# EAGLE design AND_OR (EAGLE 7.2.0)
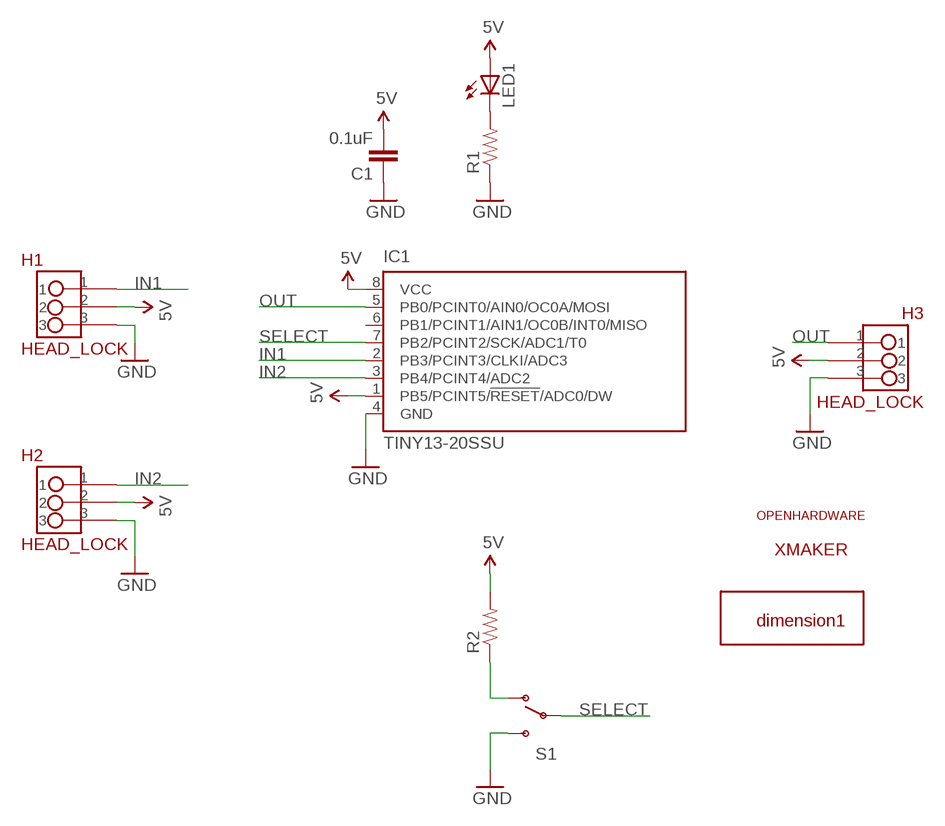
[diagram p0: schematic, sheet 1]

## Parts
C1  0.1uF  0.1UF-25V(+80/-20%)(0603)  [0603-CAP]
H1  HEAD_LOCK  [HEAD_LOCK]
H2  HEAD_LOCK  [HEAD_LOCK]
H3  HEAD_LOCK  [HEAD_LOCK]
IC1  TINY13-20SSU  [8S1]
LED1  LEDSML0603  [SML0603]
R1  RESISTOR0603-RES  [0603-RES]
R2  RESISTOR0603-RES  [0603-RES]
S1  SWITCH-SPDTKIT  [SWITCH-SPDT_KIT]
U$2  XMAKERLOGO2  [XMAKERLOGO2]
U$3  DIMENSION1  [DIMENSION1]
U$4  OPENHARDWARE  [OPENHARDWARE]

## Nets
5V: C1.2 H1.2 H2.2 H3.2 IC1.1(PB5/PCINT5/!RESET!/ADC0/DW) IC1.8(VCC) LED1.A R2.2
GND: C1.1 H1.3 H2.3 H3.3 IC1.4(GND) R1.1 S1.3(S)
IN1: H1.1 IC1.2(PB3/PCINT3/CLKI/ADC3)
IN2: H2.1 IC1.3(PB4/PCINT4/ADC2)
N$1: LED1.C R1.2
N$2: R2.1 S1.1(O)
OUT: H3.1 IC1.5(PB0/PCINT0/AIN0/OC0A/MOSI)
SELECT: IC1.7(PB2/PCINT2/SCK/ADC1/T0) S1.2(P)
Unconnected: IC1.6(PB1/PCINT1/AIN1/OC0B/INT0/MISO)

## Library data of the parts
C1 = SparkFun-Capacitors:0.1UF-25V(+80/-20%)(0603): CAP-00810 Ceramic Standard decoupling cap; PROD_ID: CAP-00810
H1-H3 = HEAD_LOCK:HEAD_LOCK: 带锁的排座
IC1 = atmel:TINY13: 8-bit AVR Microcontroller with 1K Bytes In-System Programmable Flash Source: http://www.atmel.com/dyn/resources/prod_documents/2535S.pdf; MPN: ATTINY13-20SSU; OC_FARNELL: 1455133; OC_NEWARK: 58M3771
LED1 = led:LED: LED OSRAM: - CHIPLED LG R971, LG N971, LY N971, LG Q971, LY Q971, LO R971, LY R971 LH N974, LH R974 LS Q976, LO Q976, LY Q976 LO Q996 - Hyper CHIPLED LW Q18S LB Q993, LB Q99A, LB R99A - SideLED LS A670, LO A670, LY A670, LG A670, LP A670 LB A673, LV A673, LT A673, LW A673 LH A674 LY A675 LS A676, LA A676, LO A676, LY A676, LW A676 LS A679, LY A679, LG A679 - Hyper Micro SIDELED® LS Y876, LA Y876, LO Y876, LY Y876 LT Y87S - SmartLED LW L88C, LW L88S LB L89C, LB L89S, LG L890 LS L89K, LO L89K, LY L89K LS L896, LA L896, LO L896, LY L896 - TOPLED LS T670, LO T670, LY T670, LG T670, LP T670 LSG T670, LSP T670, LSY T670, LOP T670, LYG T670 LG T671, LOG T671, LSG T671 LB T673, LV T673, LT T673, LW T673 LH T674 LS T676, LA T676, LO T676, LY T676, LB T676, LH T676, LSB T676, LW T676 LB T67C, LV T67C, LT T67C, LS T67K, LO T67K, LY T67K, LW E67C LS E67B, LA E67B, LO E67B, LY E67B, LB E67C, LV E67C, LT E67C LW T67C LS T679, LY T679, LG T679 LS T770, LO T770, LY T770, LG T770, LP T770 LB T773, LV T773, LT T773, LW T773 LH T774 LS E675, LA E675, LY E675, LS T675 LS T776, LA T776, LO T776, LY T776, LB T776 LHGB T686 LT T68C, LB T68C - Hyper Mini TOPLED® LB M676 - Mini TOPLED Santana® LG M470 LS M47K, LO M47K, LY M47K Source: http://www.osram.convergy.de LUXEON: - LUMILED® LXK2-PW12-R00, LXK2-PW12-S00, LXK2-PW14-U00, LXK2-PW14-V00 LXK2-PM12-R00, LXK2-PM12-S00, LXK2-PM14-U00 LXK2-PE12-Q00, LXK2-PE12-R00, LXK2-PE12-S00, LXK2-PE14-T00, LXK2-PE14-U00 LXK2-PB12-K00, LXK2-PB12-L00, LXK2-PB12-M00, LXK2-PB14-N00, LXK2-PB14-P00, LXK2-PB14-Q00 LXK2-PR12-L00, LXK2-PR12-M00, LXK2-PR14-Q00, LXK2-PR14-R00 LXK2-PD12-Q00, LXK2-PD12-R00, LXK2-PD12-S00 LXK2-PH12-R00, LXK2-PH12-S00 LXK2-PL12-P00, LXK2-PL12-Q00, LXK2-PL12-R00 Source: www.luxeon.com KINGBRIGHT: KA-3528ASYC Source: www.kingbright.com
R1 R2 = SparkFun-Passives:RESISTOR: Resistor Basic schematic elements and footprints for 0603, 1206, and PTH resistors.
S1 = SparkFun-Electromechanical:SWITCH-SPDT: SPDT Switch Simple slide switch, Spark Fun Electronics SKU : COM-00102 DPDT SMT slide switch, AYZ0202, SWCH-08179; PROD_ID: SWCH-08261
U$2 = Xmaker_yuhui:XMAKERLOGO2
U$3 = Xmaker_yuhui:DIMENSION1
U$4 = Xmaker_yuhui:OPENHARDWARE

## Board
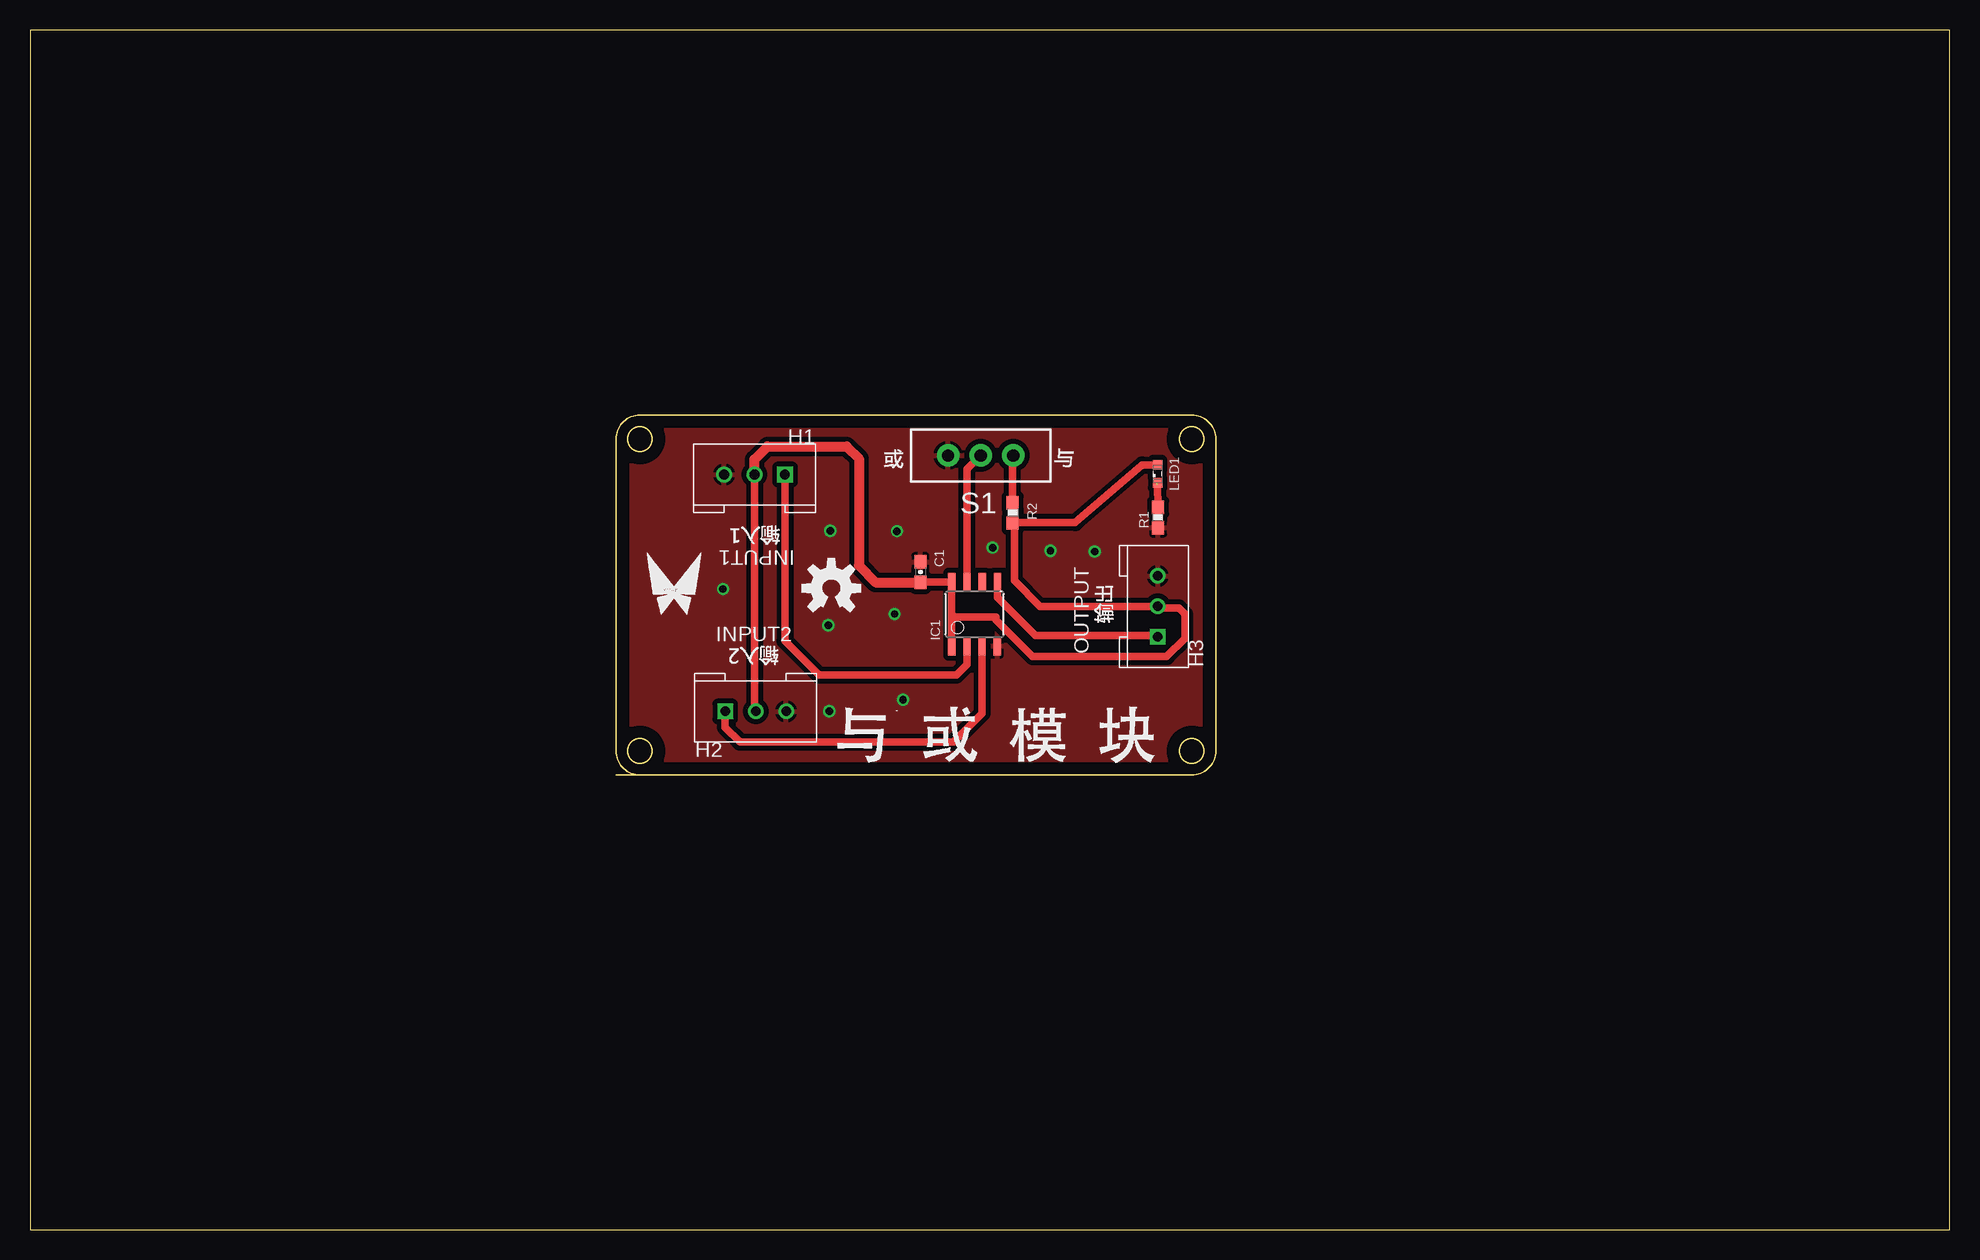
[diagram p1: board, top side]
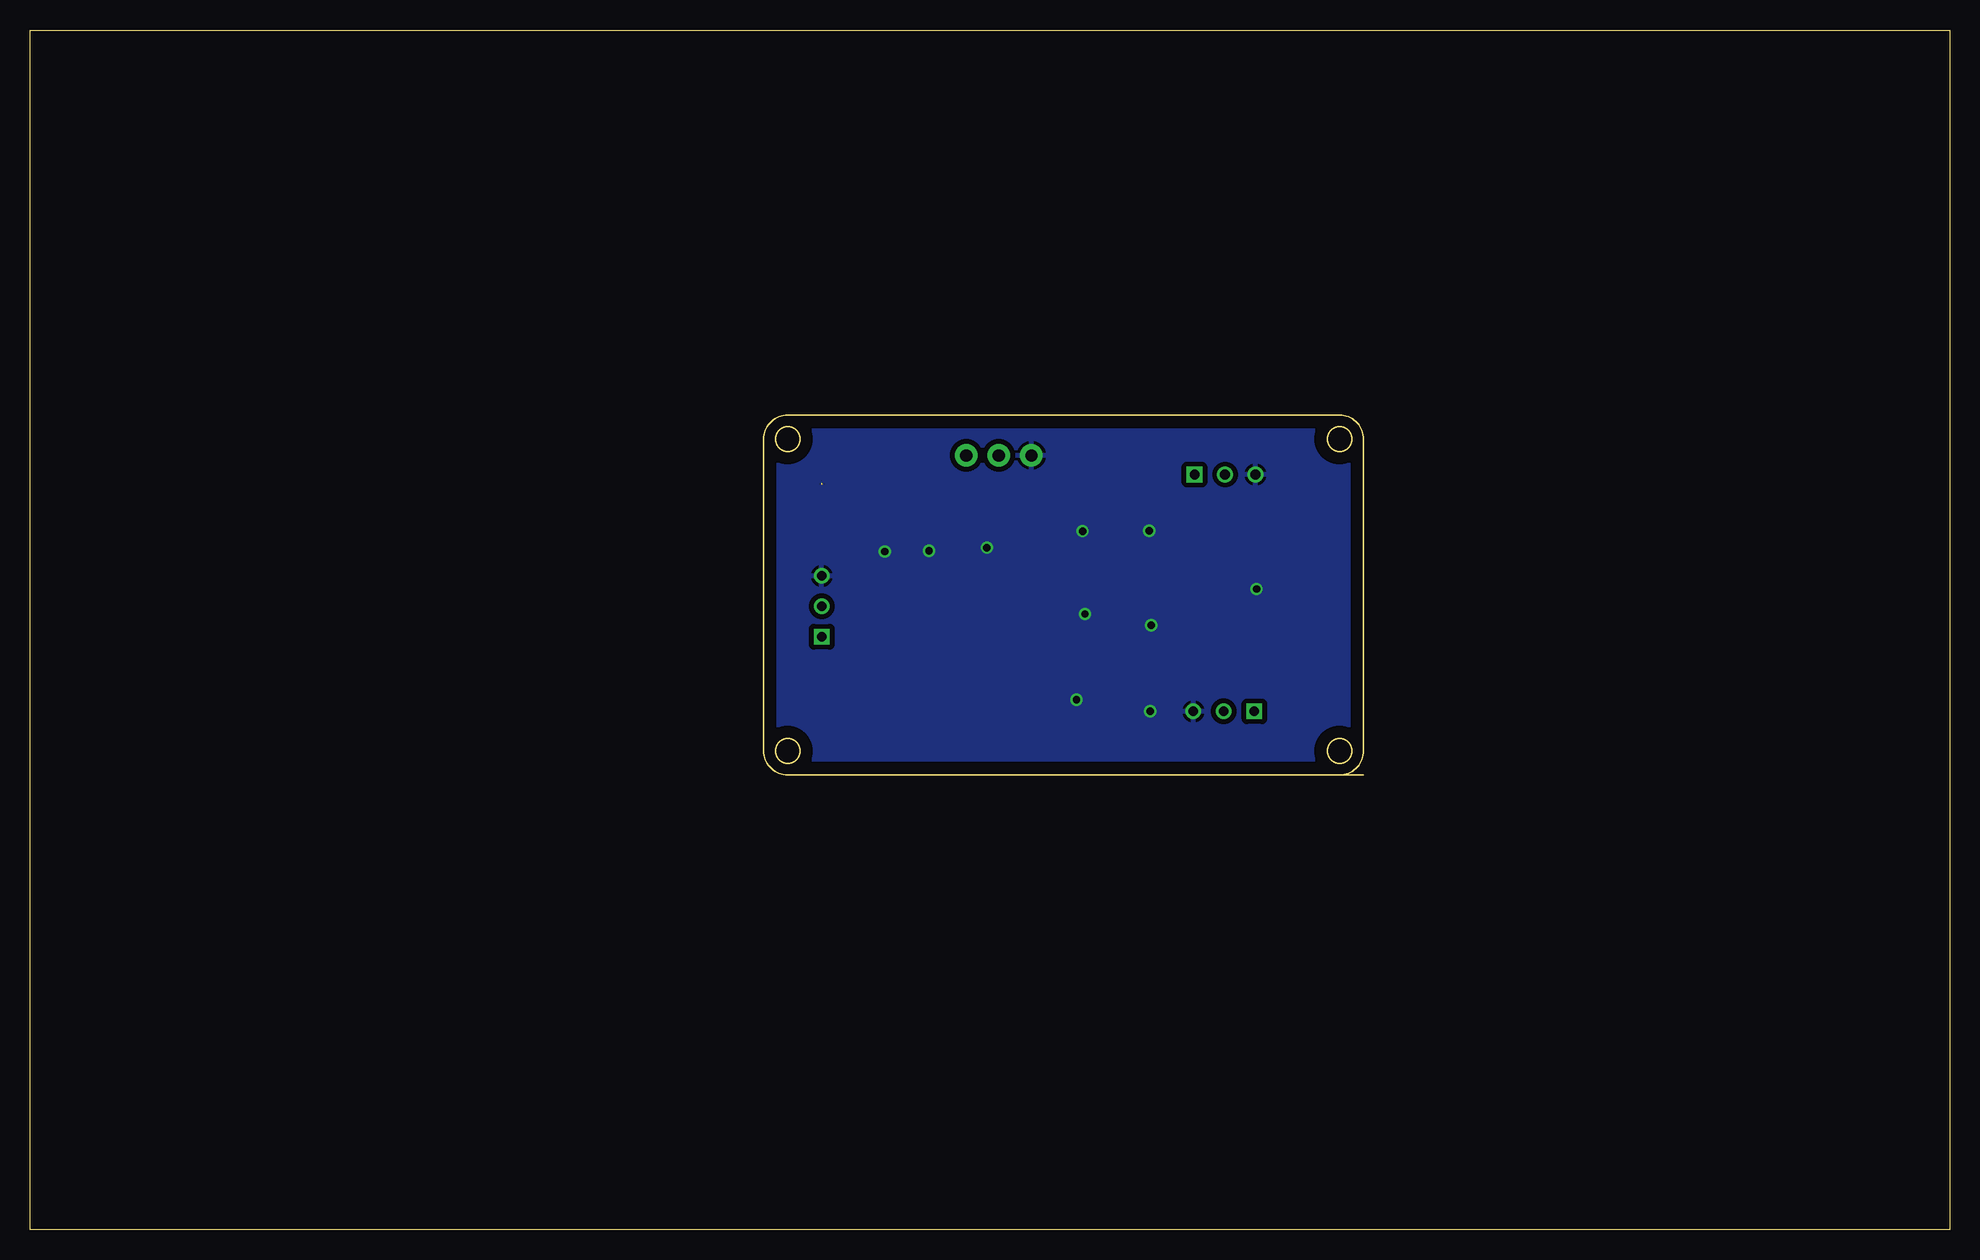
[diagram p2: board, bottom side, seen from below]

Size 160 x 100 mm. Coordinates in mm from the lower left corner, seen from the top.
Outline: 0,0 160,0 160,100 0,100 0,0
Copper layers (1*16): Top 0.035mm / dielectric 1.5mm / Bottom 0.035mm
Design rules "default": minimum track width 10mil, minimum drill 24mil, track to track 8mil, track to pad 8mil, pad to pad 8mil, via to via 8mil, smd to smd 8mil, copper to edge 40mil, drill to drill 8mil, minimum pad ring 10mil, minimum via ring 8mil, stop-mask expansion 4mil, vias tented up to drill 0mil, thermal gap 10mil

### Footprints (pad centres in the part's own frame; a part is rotated, then mirrored left to right if it is on the bottom)
0603-CAP = smd 1.1 x 1: 1 -0.85,0; 2 0.85,0
HEAD_LOCK = drill 0.8 square: 1 0,0 | drill 0.8: 2 2.54,0; 3 5.08,0
8S1 = smd 0.6 x 1.6: 1 -1.905,-2.654; 2 -0.645,-2.654; 3 0.625,-2.654; 4 1.895,-2.654; 5 1.905,2.654; 6 0.635,2.654; 7 -0.635,2.654; 8 -1.905,2.654
SML0603 = smd 0.8 x 0.8: A 0.75,0; C -0.75,0
0603-RES = smd 1.1 x 1: 1 -0.85,0; 2 0.85,0
SWITCH-SPDT_KIT = drill 1.016 pad 1.88: 1 0,2.718; 2 0,0; 3 0,-2.718

### Placement (x,y rotation side)
C1  74.22,54.82 270 top
H1  62.93,62.94 180 top
H2  57.95,43.2 0 top
H3  94.01,49.41 90 top
IC1  78.74,51.29 0 top
LED1  93.99,63 90 top
R1  94.03,59.36 90 top
R2  81.91,59.73 270 top
S1  79.24,64.53 270 top
U$2  50.16,50.32 0 top
U$3  48.84,37.9 0 top
U$4  66.8,53.47 0 top

### Tracks (layer width: path | path; a pad name or v marks a point on that pad's centre or on a via)
5V
  Top 0.61: C1.2 76.81,53.97 IC1.8 76.83,51.31 | H1.2 60.39,43.29 H2.2 | 76.83,51.31 IC1.1 | 76.83,51.31 77.09,51.05 80.52,51.05 80.52,50.8 83.57,47.75 94.74,47.75 96.27,49.28 96.27,51.31 95.76,51.82 94.14,51.82 H3.2 84.19,51.95 82.04,54.1 82.04,58.76 R2.2 81.96,58.93 87.12,58.93 92.7,63.75 LED1.A
  Top 0.813: H1.2 60.39,64.2 61.47,65.28 68.07,65.28 69.09,64.26 69.09,55.37 70.48,53.95 73.98,53.95 C1.2
GND  (via drill 0.61)
  other vias: 85.06,56.59 66.62,43.21 88.75,56.52 72.77,44.17 57.76,53.39 72.26,58.22 66.7,58.24 66.55,50.37 72.06,51.31 80.24,56.85
  pour Bottom (isolate 0.406): 47.5,69.34 101.35,69.34 101.35,35.05 47.5,35.05
  pour Top (isolate 0.406): 47.5,69.34 101.35,69.34 101.35,35.05 47.24,35.05
IN1
  Top 0.61: H1.1 62.93,49.08 65.79,46.23 77.22,46.23 77.98,46.99 78.09,47.1 IC1.2
IN2
  Top 0.61: H2.1 57.95,41.87 59.18,40.64 76.96,40.64 79.36,43.04 IC1.3
N$1  (1 unrouted)
  Top 0.61: 94,62.11 R1.2
N$2
  Top 0.61: R2.1 81.91,64.48 S1.1
OUT
  Top 0.61: IC1.5 80.64,52.71 83.82,49.53 93.89,49.53 H3.1
SELECT
  Top 0.61: IC1.7 78.1,63.39 S1.2

### Text on the board
tPlace: INPUT1 | INPUT2 | OUTPUT | C:/Users/Xiangzi/Desktop/Ãû³Æ/XMAKER_PCB3.bmp | C:/Users/Xiangzi/Desktop/Ãû³Æ/Êä³ö.bmp | C:/Users/Xiangzi/Desktop/Ãû³Æ/ÊäÈë1.bmp | C:/Users/Xiangzi/Desktop/Ãû³Æ/ÊäÈë2.bmp | C:/Users/Xiangzi/Desktop/Ãû³Æ/Óë ·Ç.bmp | C:/Users/Xiangzi/Desktop/Ãû³Æ/Óë ·Ç.bmp | C:/Users/Xiangzi/Desktop/Ãû³Æ/Óë ·Ç.bmp | C:/Users/Xiangzi/Desktop/Ãû³Æ/Óë.bmp